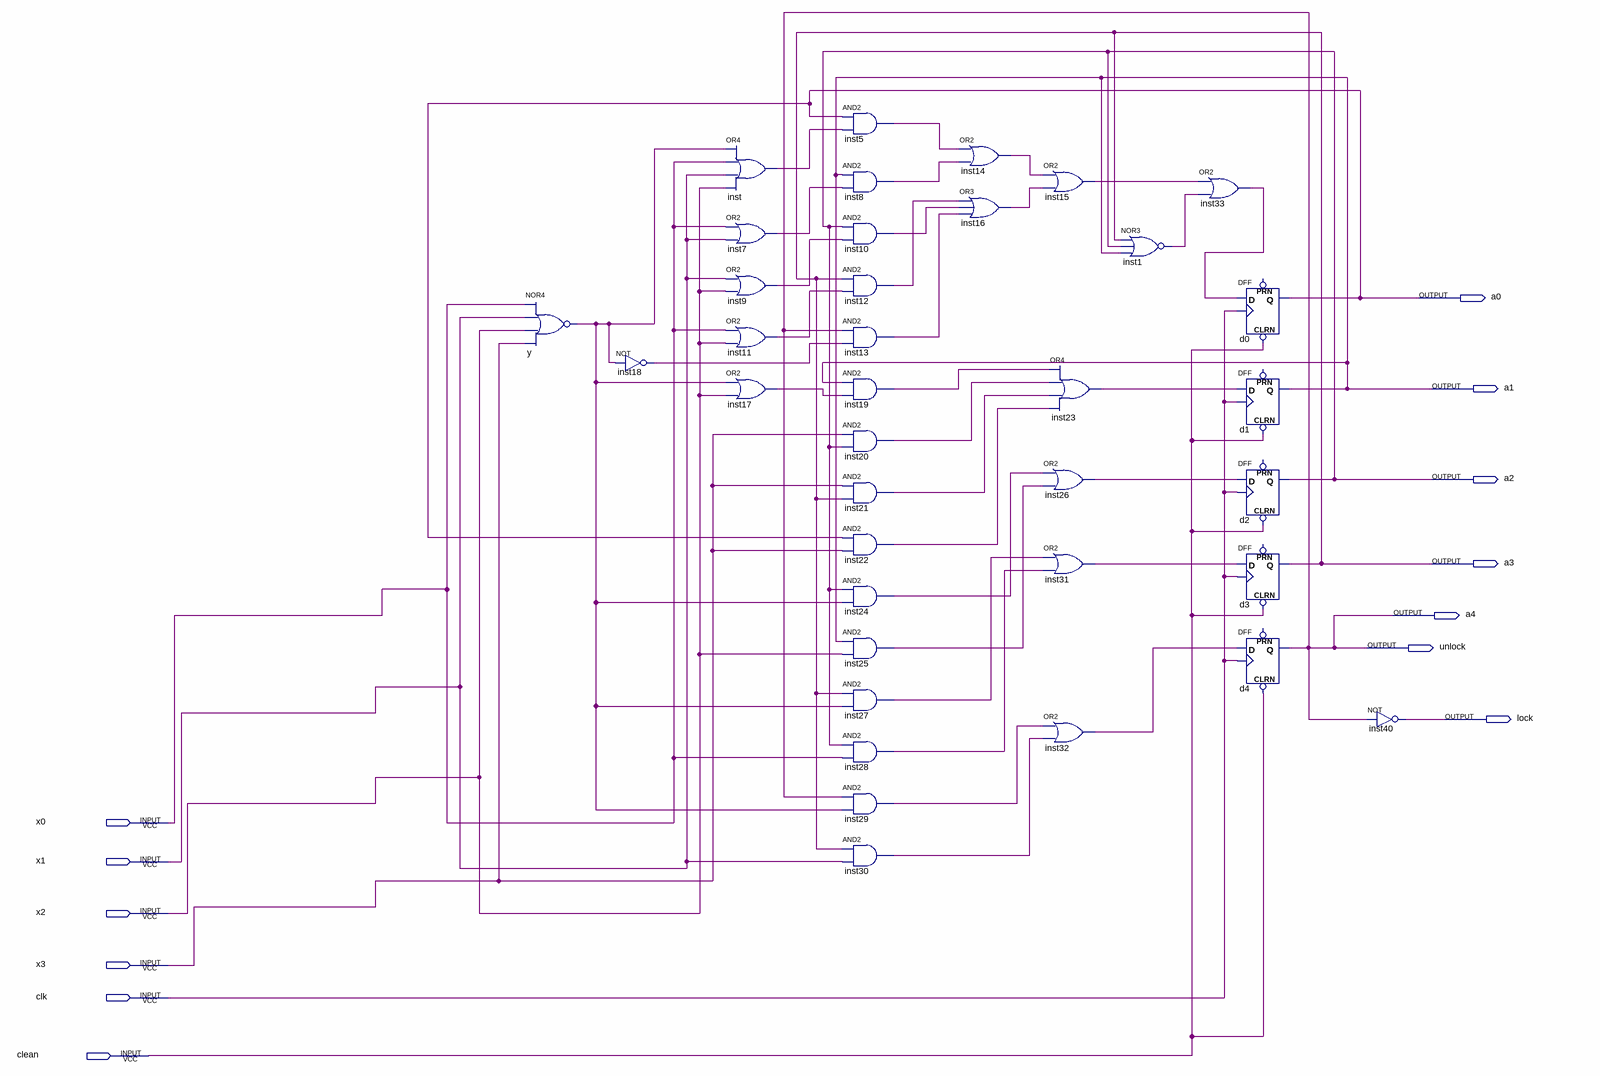
[diagram p0: schematic sheet]
// Quartus schematic lock.bdf as structural Verilog: 37 symbols, 13 pins
module lock (
  input  x0,
  input  x1,
  input  x2,
  input  x3,
  input  clk,
  input  clean,
  output a0,
  output a1,
  output a2,
  output a3,
  output a4,
  output unlock,
  output lock
);

  wire inst1_out, inst5_out, inst7_out, inst8_out, inst9_out, inst10_out, inst11_out, inst12_out, inst13_out,
       inst14_out, inst15_out, inst16_out, inst17_out, inst18_out, inst19_out, inst20_out, inst21_out,
       inst22_out, inst23_out, inst24_out, inst25_out, inst26_out, inst27_out, inst28_out, inst29_out,
       inst30_out, inst31_out, inst32_out, inst33_out, inst_out, y_out;

  nor y (y_out, x0, x1, x2, x3);
  not inst18 (inst18_out, y_out);
  or inst (inst_out, y_out, x0, x1, x2);
  or inst7 (inst7_out, x0, x1);
  or inst9 (inst9_out, x1, x2);
  or inst11 (inst11_out, x0, x2);
  or inst17 (inst17_out, y_out, x2);
  and inst5 (inst5_out, a0, inst_out);
  and inst8 (inst8_out, a1, inst7_out);
  and inst10 (inst10_out, a2, inst9_out);
  and inst12 (inst12_out, a3, inst11_out);
  and inst13 (inst13_out, a4, inst18_out);
  and inst19 (inst19_out, a1, inst17_out);
  and inst20 (inst20_out, x3, a2);
  and inst21 (inst21_out, x3, a3);
  and inst22 (inst22_out, a0, x3);
  and inst24 (inst24_out, a2, y_out);
  and inst25 (inst25_out, a1, x2);
  and inst27 (inst27_out, a3, y_out);
  and inst28 (inst28_out, a2, x0);
  and inst29 (inst29_out, a4, y_out);
  and inst30 (inst30_out, a3, x1);
  or inst14 (inst14_out, inst5_out, inst8_out);
  or inst16 (inst16_out, inst12_out, inst10_out, inst13_out);
  or inst15 (inst15_out, inst14_out, inst16_out);
  or inst26 (inst26_out, inst24_out, inst25_out);
  or inst31 (inst31_out, inst27_out, inst28_out);
  or inst32 (inst32_out, inst29_out, inst30_out);
  or inst23 (inst23_out, inst19_out, inst20_out, inst21_out, inst22_out);
  nor inst1 (inst1_out, a3, a2, a1);
  or inst33 (inst33_out, inst15_out, inst1_out);
  DFF d0 (.CLRN(clean), .CLK(clk), .D(inst33_out), .Q(a0));  // open: PRN
  DFF d1 (.CLRN(clean), .CLK(clk), .D(inst23_out), .Q(a1));  // open: PRN
  DFF d2 (.CLRN(clean), .CLK(clk), .D(inst26_out), .Q(a2));  // open: PRN
  DFF d3 (.CLRN(clean), .CLK(clk), .D(inst31_out), .Q(a3));  // open: PRN
  DFF d4 (.CLRN(clean), .CLK(clk), .D(inst32_out), .Q(a4));  // open: PRN
  not inst40 (lock, a4);

  assign unlock = a4;
endmodule
